# EAGLE schematic ActionCam (EAGLE 7.7.0)
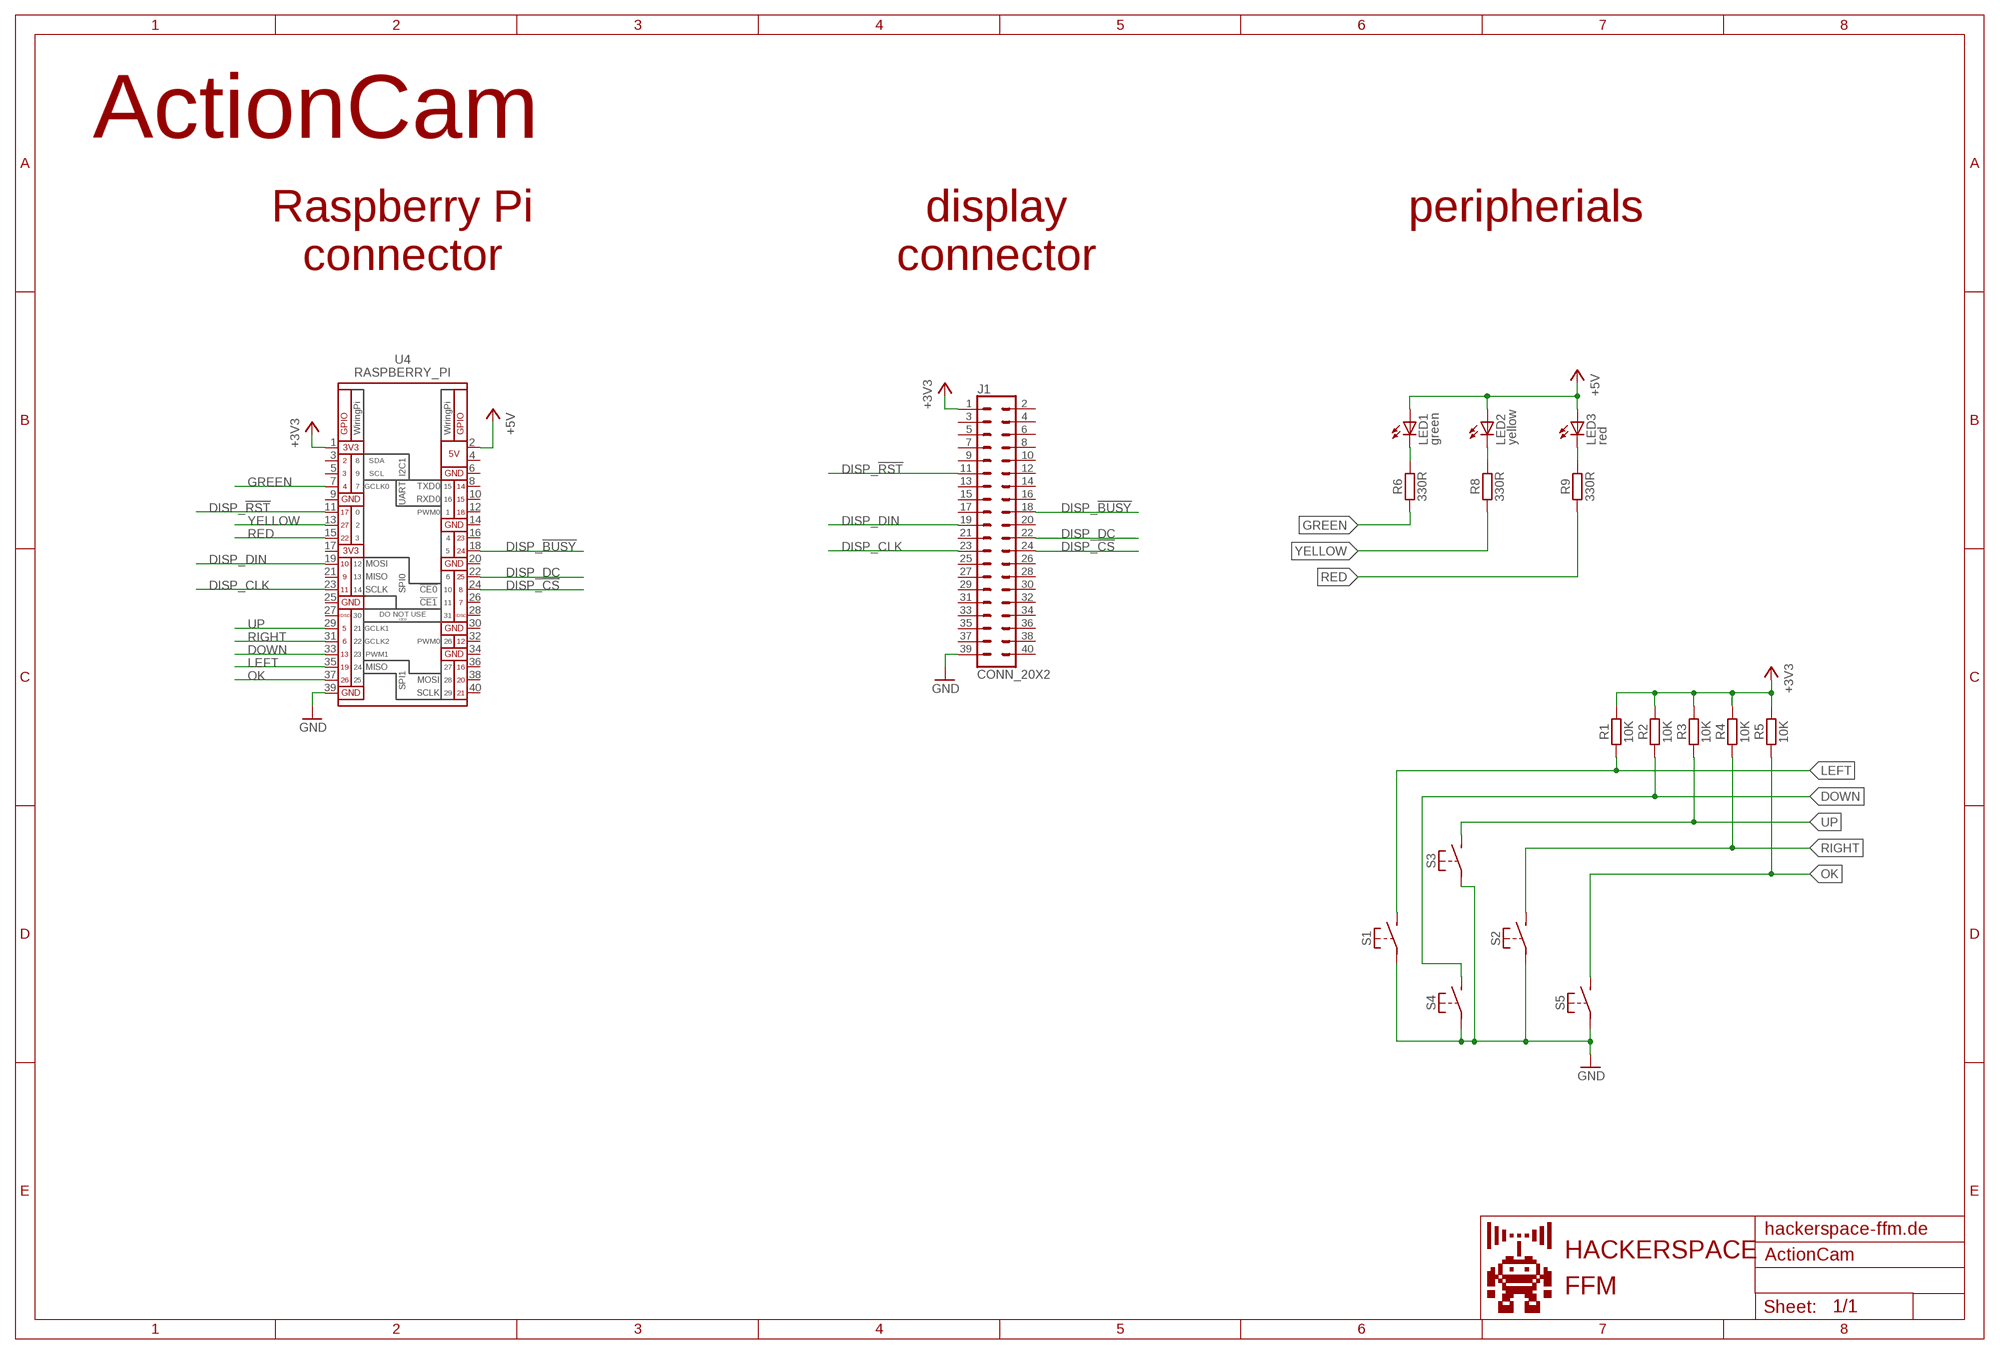
[diagram p0: schematic, sheet 1]

## Parts
J1  CONN_20X2  [2X20]
LED1  green  LED5MM  [LED5MM]
LED2  yellow  LED5MM  [LED5MM]
LED3  red  LED5MM  [LED5MM]
R1  10K  R  [R0603]
R2  10K  R  [R0603]
R3  10K  R  [R0603]
R4  10K  R  [R0603]
R5  10K  R  [R0603]
R6  330R  R  [R0603]
R8  330R  R  [R0603]
R9  330R  R  [R0603]
S1  TASTER_DUMMY  [DUMMY]
S2  TASTER_DUMMY  [DUMMY]
S3  TASTER_DUMMY  [DUMMY]
S4  TASTER_DUMMY  [DUMMY]
S5  TASTER_DUMMY  [DUMMY]
U4  RASPBERRY_PI  RASPBERRY_PI_ZERO_W_V1.1_GPIO  [RASPBERRY_PI_ZERO_W_V1.1]

## Nets
+3V3: J1.1 R1.2 R2.2 R3.2 R4.2 R5.2 U4.1(3V3)
+5V: LED1.A LED2.A LED3.A U4.2(5V)
DISP_!BUSY: J1.18 U4.18(GPIO24/GEN5)
DISP_!CS: J1.24 U4.24(GPIO8/!CE0!)
DISP_!RST: J1.11 U4.11(GPIO17/GEN0)
DISP_CLK: J1.23 U4.23(GPIO11/SCLK)
DISP_DC: J1.22 U4.22(GPIO25/GEN6)
DISP_DIN: J1.19 U4.19(GPIO10/MOSI)
DOWN: R2.1 S4.P$1 U4.33(GPIO13)
GND: J1.39 S1.P$2(C) S2.P$2(C) S3.P$2(C) S4.P$2(C) S5.P$2(C) U4.39(GND)
GREEN: R6.1 U4.7(GPIO4/GCKL)
LEFT: R1.1 S1.P$1 U4.35(GPIO19)
N$4: LED1.K(C) R6.2
N$5: LED2.K(C) R8.2
N$8: LED3.K(C) R9.2
OK: R5.1 S5.P$1 U4.37(GPIO26)
RED: R9.1 U4.15(GPIO22/GEN3)
RIGHT: R4.1 S2.P$1 U4.31(GPIO6)
UP: R3.1 S3.P$1 U4.29(GPIO5)
YELLOW: R8.1 U4.13(GPIO27/GEN2)
Unconnected: J1.2 J1.3 J1.4 J1.5 J1.6 J1.7 J1.8 J1.9 J1.10 J1.12 J1.13 J1.14 J1.15 J1.16 J1.17 J1.20 J1.21 J1.25 J1.26 J1.27 J1.28 J1.29 J1.30 J1.31 J1.32 J1.33 J1.34 J1.35 J1.36 J1.37 J1.38 J1.40 U4.3(GPIO2/SDA1) U4.4(5V) U4.5(GPIO3/SCL1) U4.6(GND) U4.8(GPIO14/TXD0) U4.10(GPIO15/RXD0) U4.12(GPIO18) U4.14(GND) U4.16(GPIO23/GEN4) U4.17(3V3) U4.20(GND) U4.21(GPIO9/MISO) U4.25(GND) U4.26(GPIO7/!CE1!) U4.27(ID_SD) U4.28(ID_SC) U4.30(GND) U4.32(GPIO12) U4.34(GND) U4.36(GPIO16) U4.38(GPIO20) U4.40(GPIO21)

## Notes on the sheet
- ActionCam
- Raspberry Pi
  connector
- display
  connector
- peripherials

## Power pins joined to a net without a drawn wire
GND: U4.9(GND)

## Library data of the parts
J1 = SparkFun-Connectors:CONN_20X2: Multi connection point. Often used as Generic Header-pin footprint for 0.1 inch spaced/style header connections On any of the 0.1 inch spaced packages, you can populate with these: Break Away Headers - Straight <https://www.sparkfun.com/products/116> (PRT-00116) Break Away Male Headers - Right Angle <https://www.sparkfun.com/products/553> (PRT-00553) Female Headers <https://www.sparkfun.com/products/115> (PRT-00115) Break Away Headers - Machine Pin <https://www.sparkfun.com/products/117> (PRT-00117) Break Away Female Headers - Swiss Machine Pin <https://www.sparkfun.com/products/743> (PRT-00743)
LED1-LED3 = led:LED: LED OSRAM: - CHIPLED LG R971, LG N971, LY N971, LG Q971, LY Q971, LO R971, LY R971 LH N974, LH R974 LS Q976, LO Q976, LY Q976 LO Q996 - Hyper CHIPLED LW Q18S LB Q993, LB Q99A, LB R99A - SideLED LS A670, LO A670, LY A670, LG A670, LP A670 LB A673, LV A673, LT A673, LW A673 LH A674 LY A675 LS A676, LA A676, LO A676, LY A676, LW A676 LS A679, LY A679, LG A679 - Hyper Micro SIDELED® LS Y876, LA Y876, LO Y876, LY Y876 LT Y87S - SmartLED LW L88C, LW L88S LB L89C, LB L89S, LG L890 LS L89K, LO L89K, LY L89K LS L896, LA L896, LO L896, LY L896 - TOPLED LS T670, LO T670, LY T670, LG T670, LP T670 LSG T670, LSP T670, LSY T670, LOP T670, LYG T670 LG T671, LOG T671, LSG T671 LB T673, LV T673, LT T673, LW T673 LH T674 LS T676, LA T676, LO T676, LY T676, LB T676, LH T676, LSB T676, LW T676 LB T67C, LV T67C, LT T67C, LS T67K, LO T67K, LY T67K, LW E67C LS E67B, LA E67B, LO E67B, LY E67B, LB E67C, LV E67C, LT E67C LW T67C LS T679, LY T679, LG T679 LS T770, LO T770, LY T770, LG T770, LP T770 LB T773, LV T773, LT T773, LW T773 LH T774 LS E675, LA E675, LY E675, LS T675 LS T776, LA T776, LO T776, LY T776, LB T776 LHGB T686 LT T68C, LB T68C - Hyper Mini TOPLED® LB M676 - Mini TOPLED Santana® LG M470 LS M47K, LO M47K, LY M47K Source: http://www.osram.convergy.de LUXEON: - LUMILED® LXK2-PW12-R00, LXK2-PW12-S00, LXK2-PW14-U00, LXK2-PW14-V00 LXK2-PM12-R00, LXK2-PM12-S00, LXK2-PM14-U00 LXK2-PE12-Q00, LXK2-PE12-R00, LXK2-PE12-S00, LXK2-PE14-T00, LXK2-PE14-U00 LXK2-PB12-K00, LXK2-PB12-L00, LXK2-PB12-M00, LXK2-PB14-N00, LXK2-PB14-P00, LXK2-PB14-Q00 LXK2-PR12-L00, LXK2-PR12-M00, LXK2-PR14-Q00, LXK2-PR14-R00 LXK2-PD12-Q00, LXK2-PD12-R00, LXK2-PD12-S00 LXK2-PH12-R00, LXK2-PH12-S00 LXK2-PL12-P00, LXK2-PL12-Q00, LXK2-PL12-R00 Source: www.luxeon.com KINGBRIGHT: KA-3528ASYC Source: www.kingbright.com
R1-R6 R8 R9 = FPV-Auto:R
S1-S5 = MyEagleLibrary:TASTER_DUMMY
U4 = FPV-Auto:RASPBERRY_PI_ZERO_W_V1.1_GPIO: Raspberry Pi Zero W The Raspberry Pi Zero W extends the Pi Zero family and comes with added wireless LAN and Bluetooth connectivity. Links GPIO Pinout guide <https://pinout.xyz/> Product website <https://www.raspberrypi.org/products/raspberry-pi-zero-w/> Connectors needed: Power & SD: 0906-4-15-20-75-14-11-0 USB data: 0985-0-15-20-71-14-11-0 GPIO: BL 1X20G 2,54 Reichelt